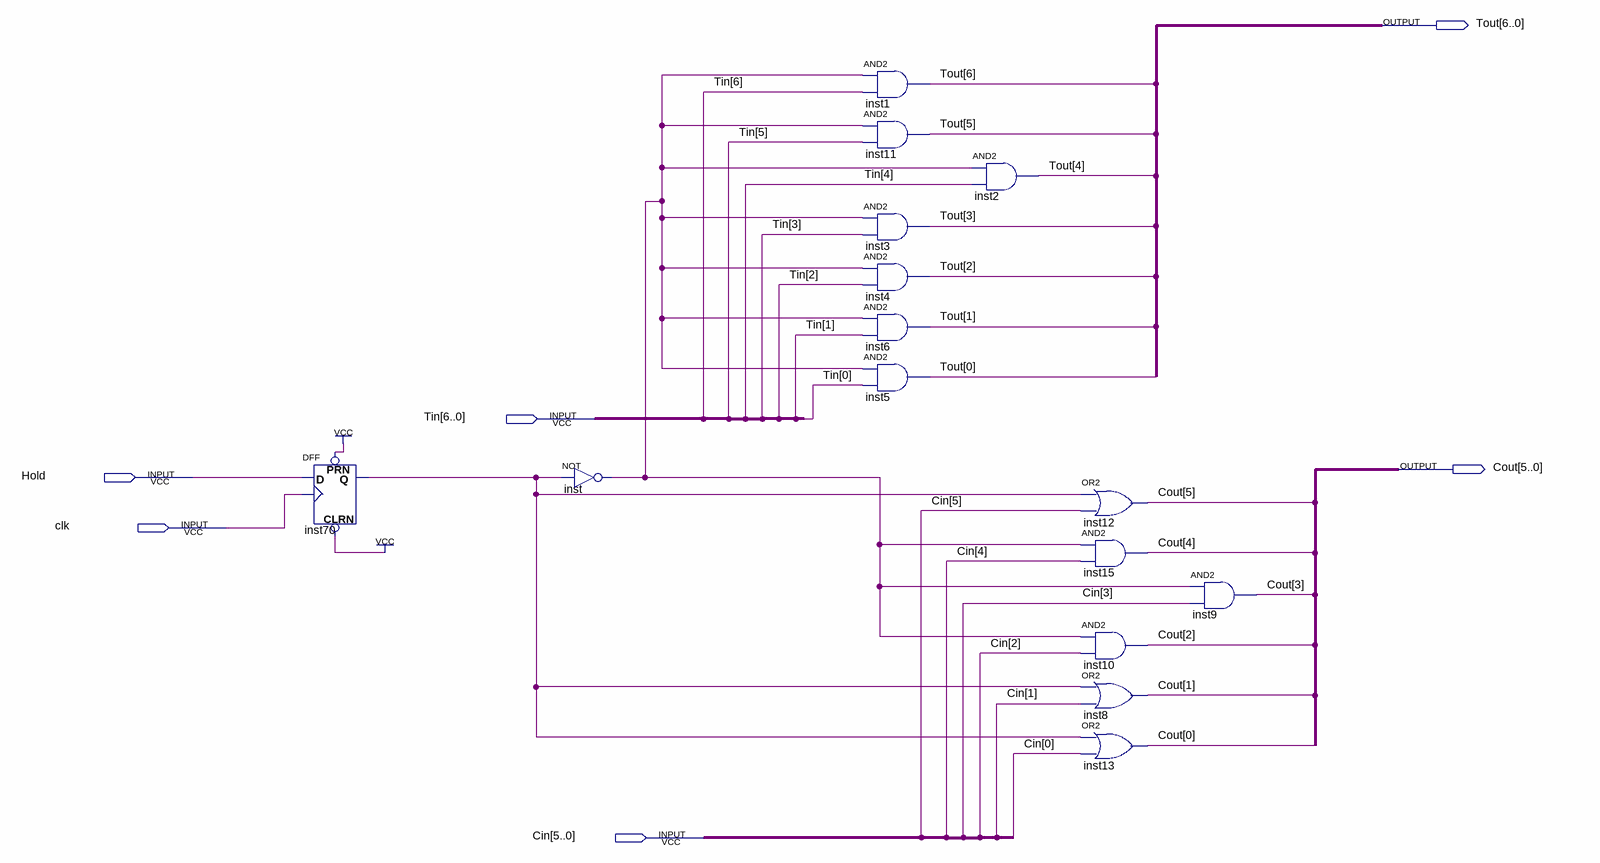
[diagram p0: schematic sheet]
// Quartus schematic UC-1.bdf as structural Verilog: 15 symbols, 6 pins
module \UC-1  (
  input  [6:0] Tin,
  input  Hold,
  input  clk,
  input  [5:0] Cin,
  output [6:0] Tout,
  output [5:0] Cout
);

  wire inst70_q, inst_out;

  DFF inst70 (.CLRN(1'b1), .CLK(clk), .D(Hold), .PRN(1'b1), .Q(inst70_q));
  not inst (inst_out, inst70_q);
  and inst1 (Tout[6], inst_out, Tin[6]);
  and inst11 (Tout[5], inst_out, Tin[5]);
  and inst3 (Tout[3], inst_out, Tin[3]);
  and inst4 (Tout[2], inst_out, Tin[2]);
  and inst6 (Tout[1], inst_out, Tin[1]);
  and inst5 (Tout[0], inst_out, Tin[0]);
  and inst2 (Tout[4], inst_out, Tin[4]);
  or inst12 (Cout[5], inst70_q, Cin[5]);
  and inst15 (Cout[4], inst_out, Cin[4]);
  and inst10 (Cout[2], inst_out, Cin[2]);
  or inst8 (Cout[1], inst70_q, Cin[1]);
  or inst13 (Cout[0], inst70_q, Cin[0]);
  and inst9 (Cout[3], inst_out, Cin[3]);
endmodule
